# EasyEDA Pro project ProDoc_Board3_2024-07-15.epro

# Schematic Schematic1
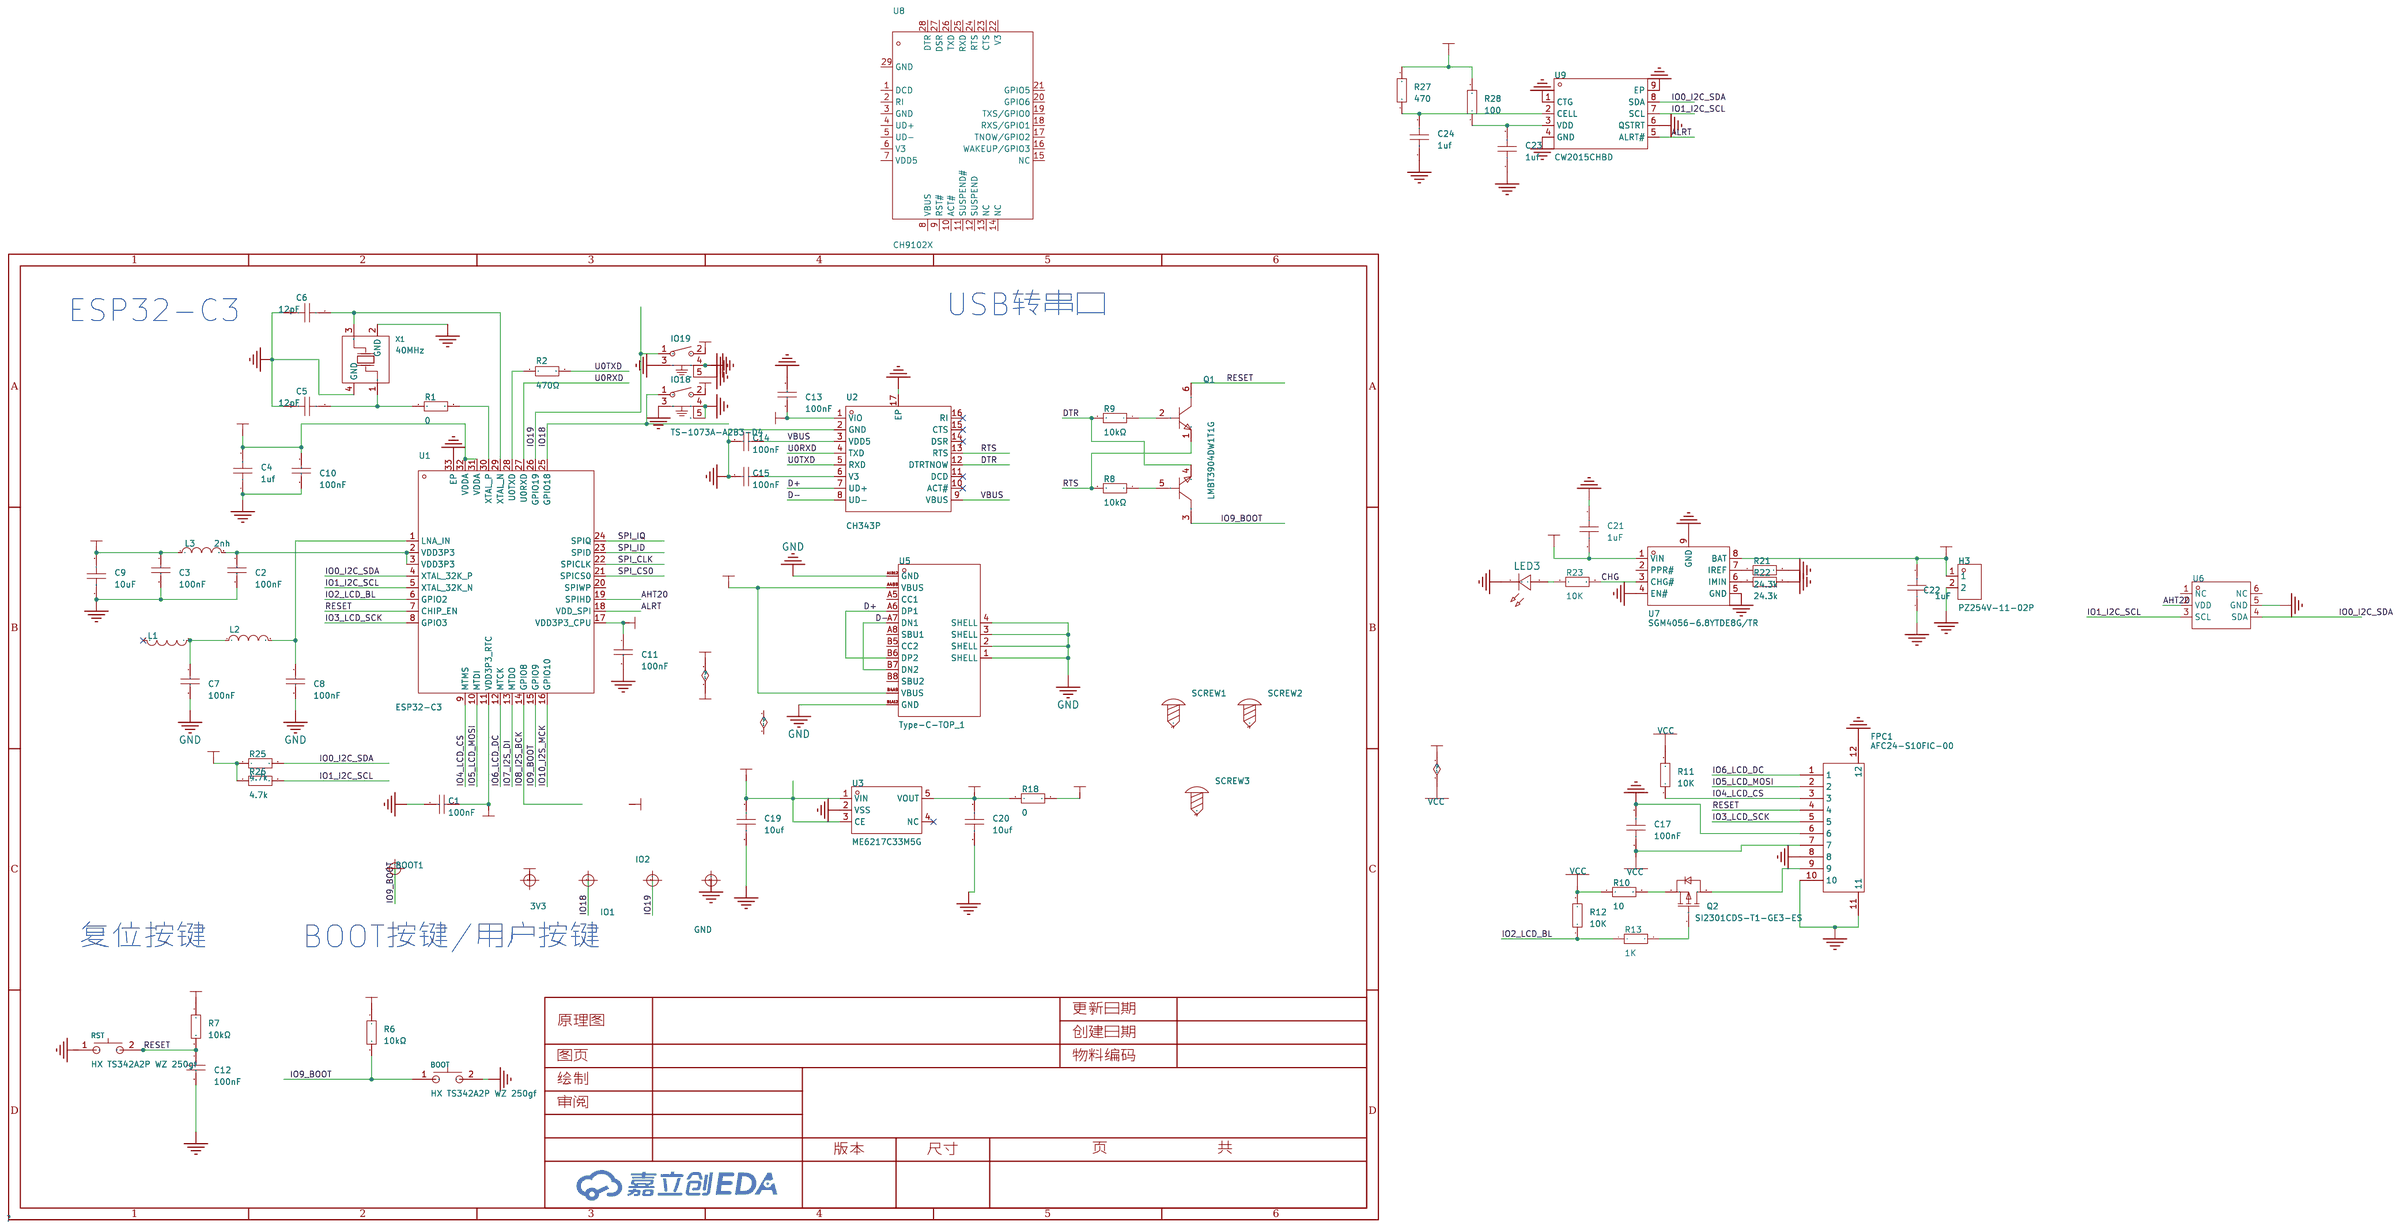
[diagram p0: schematic sheet]

## Parts
3V3  -  [Mark-Point-1mm]  (no BOM)
BOOT  HX TS342A2P WZ 250gf  [SW-SMD_L4.0-W2.9-LS5.0]
BOOT1  -  [Mark-Point-1mm]  (no BOM)
C1  100nF  [C0402]
C2  100nF  [C0402]
C3  100nF  [C0402]
C4  1uf  [C0603]
C5  12pF  [C0603]
C6  12pF  [C0603]
C7  100nF  [C0402]
C8  100nF  [C0402]
C9  10uF  [C0603]
C10  100nF  [C0402]
C11  100nF  [C0402]
C12  100nF  [C0402]
C13  100nF  [C0402]
C14  100nF  [C0402]
C15  100nF  [C0402]
C17  100nF  [C0603]
C19  10uf  [C0603]
C20  10uf  [C0603]
C21  1uF  [C0603]
C22  1uF  [C0603]
C23  1uf  [C0603]
C24  1uf  [C0603]
FPC1  AFC24-S10FIC-00  [FPC-SMD_P0.50-10P_QCHF-SM-H2.0]
GND  -  [Mark-Point-1mm]  (no BOM)
H3  PZ254V-11-02P  [HDR-TH_2P-P2.54-V-M]
IO1  -  [Mark-Point-1mm]  (no BOM)
IO2  -  [Mark-Point-1mm]  (no BOM)
IO18  TS-1073A-A2B3-D4  [SW-SMD_TS-1073A-A2B3-D4]
IO19  TS-1073A-A2B3-D4  [SW-SMD_TS-1073A-A2B3-D4]
L1  -  [ANT-SMD_L9.5-W2.1]
L2  2.2nH  [L0603]
L3  2nh  [l0603]
LED3  -  [LED_0603]
Q1  LMBT3904DW1T1G  [SOT-363_L2.0-W1.3-P0.65-LS2.1-BR]
Q2  SI2301CDS-T1-GE3-ES  [SOT-23-3_L2.9-W1.3-P1.90-LS2.4-BR]
R1  0  [r0603]
R2  470Ω  [R0603]
R6  10kΩ  [R0402]
R7  10kΩ  [R0402]
R8  10kΩ  [R0402]
R9  10kΩ  [R0402]
R10  10  [r0603]
R11  10K  [r0603]
R12  10K  [r0603]
R13  1K  [r0603]
R18  0  [r0603]
R21  24.3k  [R0402]
R22  24.3k  [R0402]
R23  10K  [R0402]
R25  4.7k  [R0402]
R26  4.7k  [R0402]
R27  470  [r0603]
R28  100  [r0603]
RST  HX TS342A2P WZ 250gf  [SW-SMD_L4.0-W2.9-LS5.0]
SCREW1  -  [M2螺丝]
SCREW2  -  [M2螺丝]
SCREW3  -  [M2螺丝]
U1  ESP32-C3  [QFN-32_L5.0-W5.0-P0.50-TL-EP3.7]
U2  CH343P  [TQFN-16_L3.0-W3.0-P0.50-BL-EP1.7]
U3  ME6217C33M5G  [SOT-23-5_L3.0-W1.7-P0.95-LS2.8-BR]
U5  Type-C-TOP_1  [USB-C-SMD_TYPE-C16PIN]
U6  AHT20  [SENSOR-SMD_L3.0-W3.0-P1.00-BR]
U7  SGM4056-6.8YTDE8G/TR  [DFN-8_L2.0-W2.0-P0.50-BL-EP-1]
U8  CH9102X  [TQFN-28_L5.0-W5.0-P0.50-BL-EP2.7]
U9  CW2015CHBD  [TDFN-8_L3.0-W2.0-P0.50-BL-EP]
X1  40MHz  [CRYSTAL-SMD_4P-L3.2-W2.5-BL-2]

## Library data of the parts
3V3 BOOT1 GND IO1 IO2 = Mark-Point: Mark点
BOOT RST = HX TS342A2P WZ 250gf: 开关长度:4mm;开关宽度:3mm;开关高度:2.5mm;机械寿命:-;; LCSC Part Name: 4*3*2.5mm 立贴 轻触开关; Supplier Part: C5143624; Manufacturer: hanxia(韩下); Supplier Footprint: SMD; JLCPCB Part Class: 扩展库; Datasheet: https://atta.szlcsc.com/upload/public/pdf/source/20220824/BD4643BA1524EF20DD35ADAFF82B8650.pdf; Supplier: LCSC; Switch Length: 4mm; Switch Width: 3mm; Switch Height: 2.5mm
C1-C3 C7 C8 C10-C15 = CL05B104KO5NNNC: 容值:100nF;精度:±10%;额定电压:16V;材质(温度系数):X7R;; LCSC Part Name: 100nF ±10% 16V; Supplier Part: C1525; Manufacturer: SAMSUNG(三星); Supplier Footprint: 0402; Datasheet: https://atta.szlcsc.com/upload/public/pdf/source/20160218/1457707763339.pdf; Supplier: LCSC; Tolerance: ±10%; Voltage Rated: 16V; Temperature Coefficient: X7R
C4-C6 C9 C17 C19-C24 = CAP_0603: Supplier Footprint: 0603
FPC1 = AFC24-S10FIC-00: 锁定特性:翻盖式;触点类型:双侧触点/上下接;触点数量:10P;间距:0.5mm;安装类型:卧贴;; LCSC Part Name: 间距:0.5mm P数:10P 翻盖式 双侧触点/上下接; Supplier Part: C262289; Manufacturer: JS(钜硕电子); Supplier Footprint: SMD,P=0.5mm,卧贴; JLCPCB Part Class: 扩展库; Datasheet: https://atta.szlcsc.com/upload/public/pdf/source/20180814/C262679_7FB2CAD07E71B2E22E52A118EE33337B.pdf; Supplier: LCSC; Locking Feature: 翻盖式; Contact Type: 双侧触点/上下接; Number of Contacts: 10P; Pitch: 0.5mm; Mounting Type: 卧贴; FFC, FCB Thickness: 0.3mm; Height Above Board: 2mm
H3 = PZ254V-11-02P: 插针结构:1x2P;间距:2.54mm;行距:-;圆针/方针:方针;安装类型:直插;排数:单排;总PIN位数:2P;额定电流:-;额定电压:-;配合针长度:6mm;塑高:2.5mm;端接针长度:3mm;触头材质:黄铜;触头镀层:-;工作温度范围:-40℃~+105℃;颜色:黑色;; LCSC Part Name: 间距:2.54mm 1x2P 直插 方针; Supplier Part: C492401; Manufacturer: XFCN(兴飞); Supplier Footprint: 插件,P=2.54mm; JLCPCB Part Class: 扩展库; Datasheet: https://atta.szlcsc.com/upload/public/pdf/source/20200309/C492401_A812433581A9B211A7FFA413ADDFF0E5.pdf; Supplier: LCSC; Pin Structure: 1x2P; Pitch: 2.54mm; Circluar Pins/Square Pins: 方针; Mounting Type: 直插; Number of Rows: 单排; Number of Pins: 2P; Length of Mating Pin: 6mm; Insulation Height: 2.5mm; Length of End Connection Pin: 3mm; Contact Material: 黄铜; Operating Temperature Range: -40℃~+105℃; Color: 黑色
IO18 IO19 = TS-1073A-A2B3-D4: 电路结构:单刀单掷;按钮形状:矩形按钮;作用力:250gf;安装方式:-;带灯:-;机械寿命:-;; LCSC Part Name: 轻触开关4.7*1.9*3.5mm侧按2*4*3.5贴片带支架250gf; Supplier Part: C492941; Manufacturer: Yuandi(元迪); JLCPCB Part Class: 扩展库; Datasheet: https://atta.szlcsc.com/upload/public/pdf/source/20200316/C492940_9943A0CF404D08218361BA1FDE575510.pdf; Supplier: LCSC; Circuit: 单刀单掷; Actuator Style: 矩形按钮; Operating Force: 250gf
L1 = AN9520-245: 2.4G陶瓷天线/适用于WIFI蓝牙; Supplier Part: C99665; Manufacturer: rainsun台湾霖昱微; Supplier Footprint: 贴片; JLCPCB Part Class: Extended Part; Datasheet: https://atta.szlcsc.com/upload/public/pdf/source/20170425/1493115807294.pdf; Supplier: LCSC; Frequency Range: 2.45GHz
L2 = SDCL1608C2N2STDF: 电感值:2.2nH;精度:±0.3nH;额定电流:500mA;饱和电流(Isat):-;直流电阻(DCR):100mΩ;; LCSC Part Name: 2.2nH ±0.3nH 500mA 100mΩ; Supplier Part: C29682; Manufacturer: Sunlord(顺络); Supplier Footprint: 0603; JLCPCB Part Class: Extended Part; Datasheet: https://atta.szlcsc.com/upload/public/pdf/source/20210916/2389196E6DC4CA1121B2D3610B126F46.pdf; Supplier: LCSC; Tolerance: ±0.3nH; Rated Current: 500mA; DC Resistance (DCR): 100mΩ
L3 = L_0603: Supplier Footprint: L0603
LED3 = LED_0603-R: Supplier Footprint: 0603
Q1 = LMBT3904DW1T1G: 晶体管类型:2个NPN;集射极击穿电压(Vceo):40V;集电极电流(Ic):200mA;功率(Pd):150mW;直流电流增益(hFE@Ic,Vce):100@10mA,1V;; Supplier: LCSC; Manufacturer: LRC(乐山无线电); Supplier Part: C131781; LCSC Part Name: 2个NPN 耐压:40V 电流:200mA; Supplier Footprint: SC-88; Datasheet: https://atta.szlcsc.com/upload/public/pdf/source/20170918/C131781_1505703476125975491.pdf; Transistor Type: 2个NPN; Collector-Emitter Breakdown Voltage (Vceo): 40V; Collector Current (Ic): 200mA; Power Dissipation (Pd): 150mW; Collector-Emitter Saturation Voltage (VCE(sat)@Ic,Ib): 300mV@50mA,5mA; DC Current Gain (hFE@Ic,Vce): 100@10mA,1V; Transition Frequency (fT): 300MHz; Operating Temperature: -55℃~+150℃@(Tj)
Q2 = SI2301CDS-T1-GE3-ES: 类型:P沟道;漏源电压(Vdss):20V;连续漏极电流(Id):3A;功率(Pd):1W;导通电阻(RDS(on)@Vgs,Id):58mΩ@4.5V,3A;; LCSC Part Name: P沟道 20V 3A; Supplier Part: C5224168; Manufacturer: ElecSuper(静芯微）; Supplier Footprint: SOT-23; Datasheet: https://atta.szlcsc.com/upload/public/pdf/source/20221027/42CFC3ED47648D38F0E217DE38FA5A17.pdf; Supplier: LCSC; Type: P沟道; Drain Source Voltage (Vdss): 20V; Continuous Drain Current (Id): 3A; Power Dissipation (Pd): 1W; Drain Source On Resistance (RDS(on)@Vgs,Id): 58mΩ@4.5V,3A; Gate Threshold Voltage (Vgs(th)@Id): 700mV@250uA
R1 R10-R13 R18 R27 R28 = Res_0603: Supplier Footprint: 0603
R2 = 0603WAF4700T5E: 电阻类型:厚膜电阻;阻值:470Ω;精度:±1%;功率:1/10W;温度系数:±100ppm/;最大工作电压:75V;工作温度范围:-55~+155;; LCSC Part Name: 470Ω ±1%; Supplier Part: C23179; Manufacturer: UNI-ROYAL(厚声); Supplier Footprint: 0603; JLCPCB Part Class: Basic Part; Datasheet: https://atta.szlcsc.com/upload/public/pdf/source/20200306/C422600_1E6D84923E4A46A82E41ADD87F860B5C.pdf; Supplier: LCSC; Type: 厚膜电阻; Tolerance: ±1%; Power(Watts): 1/10W; Temperature Coefficient: ±100ppm/; Overload Voltage (Max): 75V; Operating Temperature Range: -55~+155
R6-R9 = 0402WGF1002TCE: 电阻类型:厚膜电阻;阻值:10kΩ;精度:±1%;功率:62.5mW;温度系数:±100ppm/℃;; LCSC Part Name: 厚膜电阻 10kΩ ±1% 62.5mW; Supplier Part: C25744; Manufacturer: UNI-ROYAL(厚声); Supplier Footprint: 0402; Datasheet: https://atta.szlcsc.com/upload/public/pdf/source/20200306/C422600_1E6D84923E4A46A82E41ADD87F860B5C.pdf; Supplier: LCSC; Type: 厚膜电阻; Tolerance: ±1%; Power(Watts): 62.5mW; Temperature Coefficient: ±100ppm/℃; Overload Voltage (Max): 50V; Operating Temperature Range: -55℃~+155℃
R21-R23 R25 R26 = Res_0402: Supplier Footprint: 0402
SCREW1-SCREW3 = M2螺丝: Supplier Footprint: 插件
U1 = ESP32-C3: CPU内核:RISC-V;CPU最大主频:160MHz;工作电压范围:3V~3.6V;程序存储容量:-;程序存储器类型:-;RAM总容量:400KB;GPIO端口数量:22;; Supplier Part: C2838500; Manufacturer: ESPRESSIF(乐鑫); Supplier Footprint: QFN-32-EP(5x5); JLCPCB Part Class: 扩展库; Datasheet: https://atta.szlcsc.com/upload/public/pdf/source/20210625/C2838500_6489BE4707B1A2880AF92BF6724D19CA.pdf; Supplier: LCSC; CPU Core: RISC-V; CPU Maximum Speed: 160MHz; Operating Voltage Range: 3V~3.6V; RAM Size: 400KB; GPIO Ports Number: 22; ADC (Bit): 12bit; UART/USART: 2; I2C: 1; I2S: 1; SPI: 3; Peripheral/Function: 蓝牙协议栈；片载温度传感器；真随机数发生器；DMA；看门狗；WIFI协议栈；硬件密码算法引擎；54位Timer；PWM；RTC实时时钟; communication protocol: 蓝牙协议；WIFI协议; Watchdog: 有; Real-Time Clock: 有; Direct Memory Access: 有; Operating Temperature Range: -40℃~+105℃
U2 = CH343P: 应用功能:-;接口协议:-;; Supplier Part: C2846043; Manufacturer: WCH(南京沁恒); Supplier Footprint: TQFN-16-EP(3x3); Datasheet: https://atta.szlcsc.com/upload/public/pdf/source/20211010/C2846043_7FA705E1F14A2906F6A2AFA45FA28209.pdf; Supplier: LCSC
U3 = ME6217C33M5G: 输出类型:固定;输出极性:正;最大输入电压:7V;输出电压:3.3V;输出电流:800mA;电源纹波抑制比(PSRR):65dB@(1kHz);; Supplier Part: C427602; Manufacturer: MICRONE(南京微盟); Supplier Footprint: SOT-23-5; Datasheet: https://atta.szlcsc.com/upload/public/pdf/source/20190910/C427602_D4B9162A2E9D9EF57C60010DFDECEF37.pdf; Supplier: LCSC; Output Type: 固定; Output Polarity: 正; Number of Outputs: 1; Maximum Input Voltage: 7V; Output Voltage: 3.3V; Dropout Voltage: 180mV@(300mA); Output Current: 800mA; Power Supply Rejection Ratio (PSRR): 65dB@(1kHz)
U5 = Type-C-TOP_1: Supplier Part: C9900005857; Supplier Footprint: Type-C16P; JLCPCB Part Class: 扩展库; Supplier: LCSC
U6 = AHT20: Supplier Part: C2757850; Manufacturer: 广州奥松; Supplier Footprint: SMD; JLCPCB Part Class: 扩展库; Datasheet: https://atta.szlcsc.com/upload/public/pdf/source/20231023/00557B34ED120268320A4810FF8DED4D.pdf; Supplier: LCSC
U7 = SGM4056-6.8YTDE8G/TR: Supplier Part: C699732; Manufacturer: SGMICRO(圣邦微); Supplier Footprint: TDFN-8L(2x2); JLCPCB Part Class: 扩展库; Supplier: LCSC
U8 = CH9102X_C5187522: 应用功能:USB转UART;; Supplier Part: C5187522; Manufacturer: WCH(南京沁恒); Supplier Footprint: QFN-28(5x5); JLCPCB Part Class: 扩展库; Datasheet: https://atta.szlcsc.com/upload/public/pdf/source/20240313/AF0D9A0C8A705CD7DAC68F5AA4A0187A.pdf; Supplier: LCSC; Applications Function: USB转UART; Supply Voltage: 1.8V~5V
U9 = CW2015CHBD: Supplier Part: C881838; Manufacturer: Cellwise(赛微); Supplier Footprint: TDFN-8-EP(2x3); Datasheet: https://atta.szlcsc.com/upload/public/pdf/source/20210512/C881838_09B0689D9538DF441B283DD8D668F2A7.pdf; Supplier: LCSC
X1 = TXM40M0004322HBCEO00T: 频率:40MHz;频率公差:±10ppm;负载电容:15pF;; LCSC Part Name: 40MHz ±10ppm 15pF; Supplier Part: C284179; Manufacturer: TAE(雅晶鑫); Supplier Footprint: SMD3225-4P; Datasheet: https://atta.szlcsc.com/upload/public/pdf/source/20180910/C284179_2ACC6381EF288E18F29855CB4CF503EF.pdf; Supplier: LCSC; Crystal Type: 贴片无源晶振; Frequency Tolerance: ±10ppm; Frequency Stability: ±30ppm; Load Capacitance: 15pF; Equivalent Series Resistance (ESR): 30Ω; Operating Temperature: -40℃~+85℃

## Nets
3V3: 3V3.1 C1.1 C3.1 C4.2 C9.2 C10.1 C11.1 C13.1 C17.1 C20.2 C22.2 FPC1.7 H3.1 IO18.2 IO19.2 L3.1 R6.1 R7.1 R10.1 R11.2 R12.2 R18.1 R25.1 R26.1 R27.2 R28.2 U1.11(VDD3P3_RTC) U1.17(VDD3P3_CPU) U1.31(VDDA) U1.32(VDDA) U2.1(VIO) U3.5(VOUT) U7.8(BAT)
+5V: C14.1 C19.2 C21.2 U2.3(VDD5) U2.9(VBUS) U3.1(VIN) U3.3(CE) U5.A4B9(VBUS) U5.B4A9(VBUS) U7.1(VIN)
GND: BOOT.2 C1.2 C2.2 C3.2 C4.1 C5.1 C6.1 C7.2 C8.2 C9.1 C10.2 C11.2 C12.2 C13.2 C14.2 C15.1 C17.2 C19.1 C20.1 C21.1 C22.1 C23.1 C24.1 FPC1.6 FPC1.8 FPC1.10 FPC1.11 FPC1.12 GND.1 H3.2 IO18.3(EP) IO18.4(EP) IO18.5(EP) IO19.3(EP) IO19.4(EP) IO19.5(EP) LED3.1(C) R21.2 R22.2 RST.1 U1.33(EP) U2.2(GND) U2.17(EP) U3.2(VSS) U5.1(SHELL) U5.2(SHELL) U5.3(SHELL) U5.4(SHELL) U5.A1B12(GND) U5.B1A12(GND) U6.5(GND) U7.4(EN#) U7.5(GND) U7.9(GND) U9.1(CTG) U9.4(GND) U9.6(QSTRT) U9.9(EP) X1.2(GND) X1.4(GND)
AHT20: U1.19(SPIHD) U6.2(VDD)
ALRT: U1.18(VDD_SPI) U9.5(ALRT#)
AU_3V3: R18.2
CHG: R23.2 U7.3(CHG#)
D+: U2.7(UD+) U5.A6(DP1) U5.B6(DP2)
D-: U2.8(UD-) U5.A7(DN1) U5.B7(DN2)
DTR: Q1.4(E) R9.2 U2.12(DTRTNOW)
IO0_I2C_SDA: R25.2 U1.4(XTAL_32K_P) U6.4(SDA) U9.8(SDA)
IO1_I2C_SCL: R26.2 U1.5(XTAL_32K_N) U6.3(SCL) U9.7(SCL)
IO2_LCD_BL: R12.1 R13.1 U1.6(GPIO2)
IO3_LCD_SCK: FPC1.5 U1.8(GPIO3)
IO4_LCD_CS: FPC1.3 R11.1 U1.9(MTMS)
IO5_LCD_MOSI: FPC1.2 U1.10(MTDI)
IO6_LCD_DC: FPC1.1 U1.12(MTCK)
IO7_I2S_DI: U1.13(MTDO)
IO8_I2S_BCK: U1.14(GPIO8)
IO9_BOOT: BOOT.1 BOOT1.1 Q1.3(C) R6.2 U1.15(GPIO9)
IO10_I2S_MCK: U1.16(GPIO10)
IO18: IO1.1 IO18.1 U1.25(GPIO18)
IO19: IO2.1 IO19.1 U1.26(GPIO19)
RESET: C12.1 FPC1.4 Q1.6(C) R7.2 RST.2 U1.7(CHIP_EN)
RTS: Q1.1(E) R8.2 U2.13(RTS)
SPI_CLK: U1.22(SPICLK)
SPI_CS0: U1.21(SPICS0)
SPI_ID: U1.23(SPID)
SPI_IQ: U1.24(SPIQ)
U0RXD: U1.27(U0RXD) U2.4(TXD)
U0TXD: R2.2 U2.5(RXD)
$1N1202: C2.1 L3.2 U1.2(VDD3P3) U1.3(VDD3P3)
$1N1206: R2.1 U1.28(U0TXD)
$1N1211: C8.1 L2.2 U1.1(LNA_IN)
$1N1212: R1.2 U1.30(XTAL_P)
$1N1213: C6.2 U1.29(XTAL_N) X1.3(OSC2)
$1N1214: C5.2 R1.1 X1.1(OSC1)
$1N1418: C7.1 L1.1 L2.1
$1N2848: C15.2 U2.6(V3)
$1N2873: Q1.5(B) R8.1
$1N2874: Q1.2(B) R9.1
$1N5150: FPC1.9 Q2.3(D)
$1N5159: Q2.1(G) R13.2
$1N5160: Q2.2(S) R10.2
$1N13318: R21.1 U7.7(IREF)
$1N13361: R22.1 U7.6(IMIN)
$1N13443: LED3.2(A) R23.1
$1N22115: C23.2 R28.1 U9.3(VDD)
$1N22200: C24.2 R27.1 U9.2(CELL)

Not connected (* = marked no-connect by the designer): L1 2*; SCREW1 1; SCREW2 1; SCREW3 1; U1 20(SPIWP); U2 10(ACT#)* 11(DCD)* 14(DSR)* 15(CTS)* 16(RI)*; U3 4(NC)*; U5 A5(CC1) A8(SBU1) B5(CC2) B8(SBU2); U6 1(NC) 6(NC); U7 2(PPR#); U8 1(DCD) 2(RI) 3(GND) 4(UD+) 5(UD-) 6(V3) 7(VDD5) 8(VBUS) 9(RST#) 10(ACT#) 11(SUSPEND#) 12(SUSPEND) 13(NC) 14(NC) 15(NC) 16(WAKEUP/GPIO3) 17(TNOW/GPIO2) 18(RXS/GPIO1) 19(TXS/GPIO0) 20(GPIO6) 21(GPIO5) 22(V3) 23(CTS) 24(RTS) 25(RXD) 26(TXD) 27(DSR) 28(DTR) 29(GND)

## Notes on the sheet
- ESP32-C3
- USB转串口
- 复位按键
- BOOT按键/用户按键

# Board PCB4
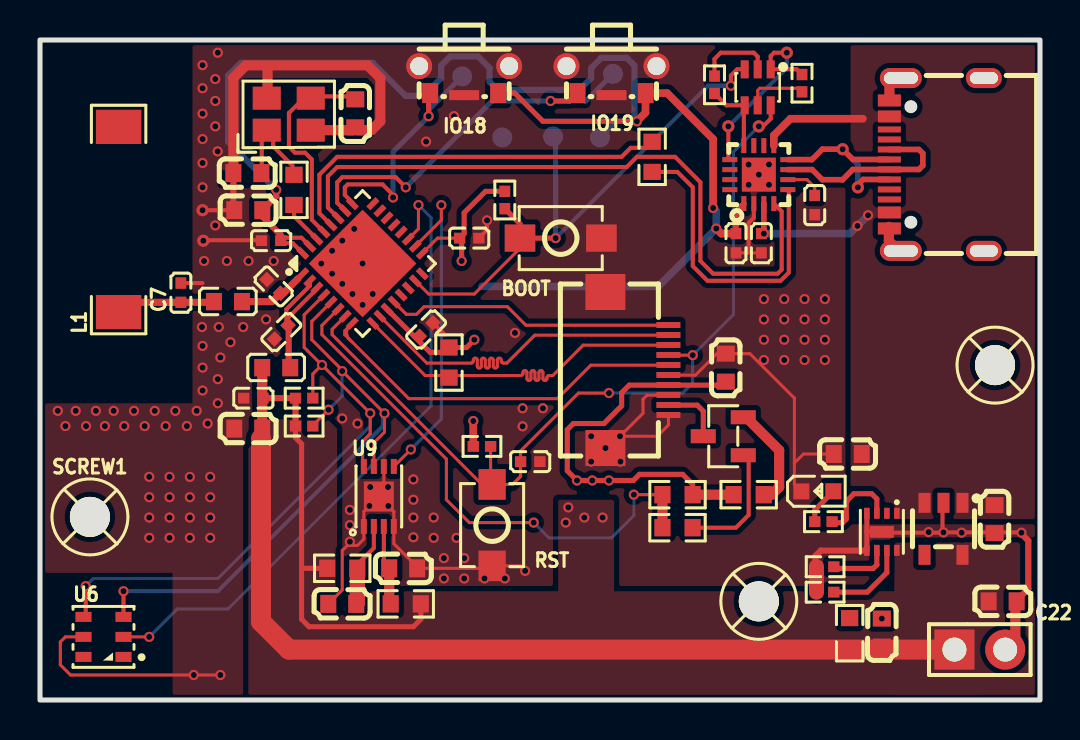
[diagram p1: board, top side]
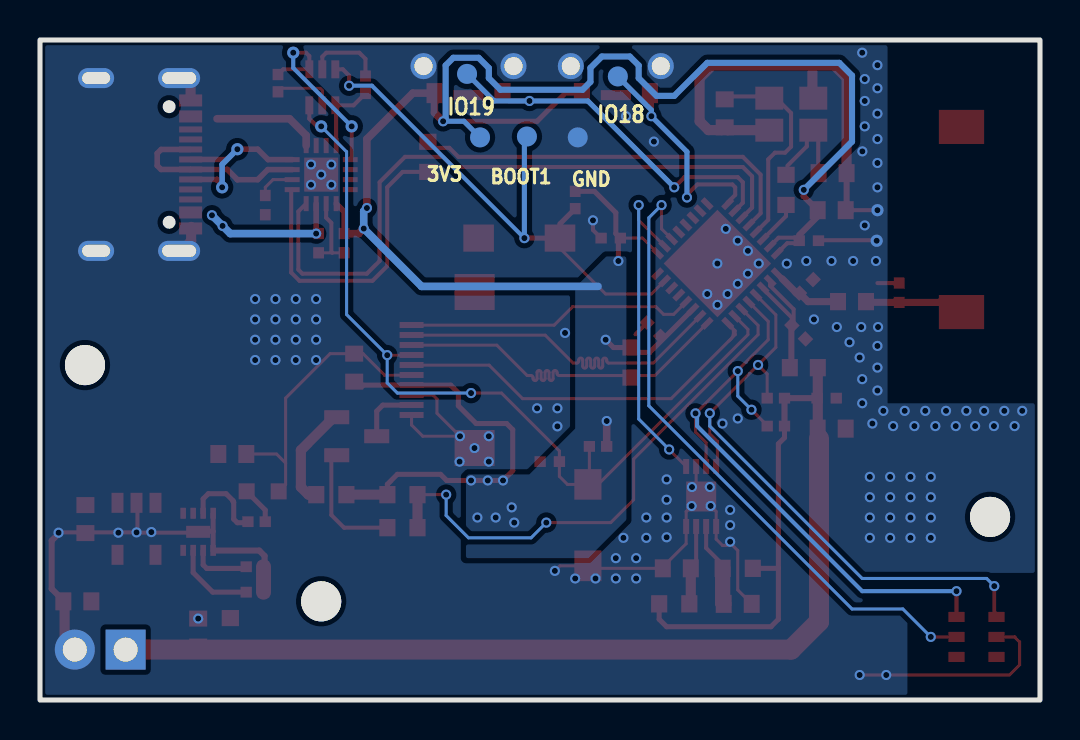
[diagram p2: board, bottom side, seen from below]

Outline 50 x 33 mm; copper layers: Top Layer, Bottom Layer. Coordinates in mm from the lower left corner of the outline.
Outline path: rectangle 0,33 50,0
Stack: Top Layer 0.035mm / Dielectric1 1.51mm FR4 er 4.5 / Bottom Layer 0.035mm

## Design rules (mm)
net IO5_LCD_MOSI: DP2
net IO3_LCD_SCK: DP2
net D+: DP1
net D-: DP1
template: 自定义配置
spacing copperThickness1oz (default): track to track 0.102, other pairs 0.152 to 0.3
spacing copperThickness2oz: track to track 0.203, other pairs 0.152 to 0.3
track width copperThickness1oz (default): min 0.152, default 0.152, max 2.54
track width copperThickness2oz: min 0.203, default 0.254, max 2.54
differential pair differentialPair (default): width min 0.127, default 0.152, max 2.54; gap min 0.152, default 0.152
via viaSize (default): diameter min 0.5, default 0.508, max 10; hole min 0.3, default 0.305, max 6.299

## Placement (name value [footprint] x y rotation side)
3V3  -  [Mark-Point-1mm]  28 28.13 180 bottom
BOOT  HX TS342A2P WZ 250gf  [SW-SMD_L4.0-W2.9-LS5.0]  26.03 23.09 0 top
BOOT1  -  [Mark-Point-1mm]  25.65 28.17 180 bottom
C1  100nF  [C0402]  21.46 23.09 0 top
C2  100nF  [C0402]  12.06 18.39 225 top
C3  100nF  [C0402]  10.67 15.09 180 top
C4  1uf  [C0603]  10.41 24.49 0 top
C5  12pF  [C0603]  10.37 26.34 0 top
C6  12pF  [C0603]  15.76 29.33 90 top
C7  100nF  [C0402]  7.04 20.36 90 top
C8  100nF  [C0402]  11.68 20.68 135 top
C9  10uF  [C0603]  10.41 13.57 0 top
C10  100nF  [C0402]  11.56 22.97 180 top
C11  100nF  [C0402]  19.3 18.52 45 top
C12  100nF  [C0402]  24.51 11.92 0 top
C13  100nF  [C0402]  34.8 22.84 270 top
C14  100nF  [C0402]  36.07 22.84 270 top
C15  100nF  [C0402]  38.74 24.75 90 top
C17  100nF  [C0603]  34.29 16.62 90 top
C19  10uf  [C0603]  47.73 9.04 90 top
C20  10uf  [C0603]  42.09 3.37 270 top
C21  1uF  [C0603]  40.39 12.3 0 top
C22  1uF  [C0603]  48.13 4.93 180 top
C23  1uf  [C0603]  18.16 6.58 180 top
C24  1uf  [C0603]  15.11 4.81 0 top
FPC1  AFC24-S10FIC-00  [FPC-SMD_P0.50-10P_QCHF-SM-H2.0]  29.84 16.5 90 top
GND  -  [Mark-Point-1mm]  23.11 28.13 180 bottom
H3  PZ254V-11-02P  [HDR-TH_2P-P2.54-V-M]  46.99 2.52 0 top
IO1  -  [Mark-Point-1mm]  21.11 31.18 180 bottom
IO2  -  [Mark-Point-1mm]  28.65 31.31 180 bottom
IO18  TS-1073A-A2B3-D4  [SW-SMD_TS-1073A-A2B3-D4]  21.21 30.97 0 top
IO19  TS-1073A-A2B3-D4  [SW-SMD_TS-1073A-A2B3-D4]  28.57 30.97 0 top
L1  -  [ANT-SMD_L9.5-W2.1]  3.93 24.02 90 top
L2  2.2nH  [L0603]  9.4 19.92 0 top
L3  2nh  [l0603]  11.81 16.62 0 top
LED3  -  [LED_0603]  38.92 10.44 0 top
Q1  LMBT3904DW1T1G  [SOT-363_L2.0-W1.3-P0.65-LS2.1-BR]  35.88 30.63 90 top
Q2  SI2301CDS-T1-GE3-ES  [SOT-23-3_L2.9-W1.3-P1.90-LS2.4-BR]  34.16 13.19 0 top
R1  0  [r0603]  12.7 25.51 270 top
R2  470Ω  [R0603]  30.61 27.16 270 top
R6  10kΩ  [R0402]  23.24 25 270 top
R7  10kΩ  [R0402]  22.1 12.68 0 top
R8  10kΩ  [R0402]  38.1 30.84 90 top
R9  10kΩ  [R0402]  33.73 30.76 270 top
R10  10  [r0603]  35.43 10.27 0 top
R11  10K  [r0603]  20.45 16.87 90 top
R12  10K  [r0603]  31.88 10.27 0 top
R13  1K  [r0603]  31.88 8.62 0 top
R18  0  [r0603]  40.48 3.34 90 top
R21  24.3k  [R0402]  39.26 5.39 180 top
R22  24.3k  [R0402]  39.26 6.66 180 top
R23  10K  [R0402]  39.17 8.92 0 top
R25  4.7k  [R0402]  13.21 15.09 0 top
R26  4.7k  [R0402]  13.21 13.7 0 top
R27  470  [r0603]  15.11 6.58 180 top
R28  100  [r0603]  18.29 4.81 0 top
RST  HX TS342A2P WZ 250gf  [SW-SMD_L4.0-W2.9-LS5.0]  22.61 8.74 90 top
SCREW1  -  [M2螺丝]  2.5 9.16 0 top
SCREW2  -  [M2螺丝]  47.75 16.74 0 top
SCREW3  -  [M2螺丝]  35.94 4.93 0 top
U1  ESP32-C3  [QFN-32_L5.0-W5.0-P0.50-TL-EP3.7]  16.13 21.82 45 top
U2  CH343P  [TQFN-16_L3.0-W3.0-P0.50-BL-EP1.7]  35.94 26.27 0 top
U3  ME6217C33M5G  [SOT-23-5_L3.0-W1.7-P0.95-LS2.8-BR]  45.17 8.56 90 top
U5  Type-C-TOP_1  [USB-C-SMD_TYPE-C16PIN]  44.83 26.78 90 top
U6  AHT20  [SENSOR-SMD_L3.0-W3.0-P1.00-BR]  3.17 3.16 0 top
U7  SGM4056-6.8YTDE8G/TR  [DFN-8_L2.0-W2.0-P0.50-BL-EP-1]  42.09 8.41 180 top
U9  CW2015CHBD  [TDFN-8_L3.0-W2.0-P0.50-BL-EP]  16.94 10.18 0 top
X1  40MHz  [CRYSTAL-SMD_4P-L3.2-W2.5-BL-2]  12.44 29.29 0 top

## Footprints (pads in the part's own frame, mm; a bottom-side part is the same pattern mirrored in y, then rotated)
ANT-SMD_L9.5-W2.1
  rect 1.71x2.268 smd: 1(-4.63,0) 2(4.63,0)
C0402
  rect 0.566x0.54 smd: 1(-0.481,0) 2(0.481,0)
C0603
  rect 0.8x0.9 smd: 1(-0.7,0) 2(0.7,0)
CRYSTAL-SMD_4P-L3.2-W2.5-BL-2
  rect 1.4x1.15 smd: 1(-1.1,-0.8) 2(1.1,-0.8) 3(1.1,0.8) 4(-1.1,0.8)
DFN-8_L2.0-W2.0-P0.50-BL-EP-1
  rect 0.28x0.55 smd: 1(-0.75,-0.927) 2(-0.25,-0.927) 3(0.25,-0.927) 4(0.75,-0.927) 5(0.75,0.927) 6(0.25,0.927) 7(-0.25,0.927) 8(-0.75,0.927)
  rect 1.2x0.6 smd: 9(0,0)
FPC-SMD_P0.50-10P_QCHF-SM-H2.0
  rect 0.3x1.2 smd: 1(2.25,-1.575) 2(1.752,-1.576) 3(1.252,-1.576) 4(0.752,-1.576) 5(0.252,-1.576) 6(-0.248,-1.576) 7(-0.748,-1.576) 8(-1.248,-1.576) 9(-1.748,-1.576) 10(-2.248,-1.576)
  rect 1.8x2 smd: 11(3.9,1.576) 12(-3.9,1.575)
HDR-TH_2P-P2.54-V-M
  rect 2x2 hole 1.2: 1(-1.27,0)
  round 2 hole 1.2: 2(1.27,0)
L0603
  rect 0.8x0.864 smd: 1(-0.7,0) 2(0.7,0)
l0603
  rect 0.8x0.864 smd: 1(-0.7,0) 2(0.7,0)
LED_0603
  rect 0.8x0.8 smd: 1(-0.851,-0.01) 2(0.75,-0.005)
M2螺丝
  round 2 hole 2: 1(0,0)
Mark-Point-1mm
  round 1 smd: 1(0,0)
QFN-32_L5.0-W5.0-P0.50-TL-EP3.7
  rect 0.65x0.28 smd: 1(-2.478,1.75) 2(-2.478,1.25) 3(-2.478,0.75) 4(-2.478,0.25) 5(-2.478,-0.25) 6(-2.478,-0.75) 7(-2.478,-1.25) 8(-2.478,-1.75) 17(2.478,-1.75) 18(2.478,-1.25) 19(2.478,-0.75) 20(2.478,-0.25) 21(2.478,0.25) 22(2.478,0.75) 23(2.478,1.25) 24(2.478,1.75)
  rect 0.28x0.65 smd: 9(-1.75,-2.478) 10(-1.25,-2.478) 11(-0.75,-2.478) 12(-0.25,-2.478) 13(0.25,-2.478) 14(0.75,-2.478) 15(1.25,-2.478) 16(1.75,-2.478) 25(1.75,2.478) 26(1.25,2.478) 27(0.75,2.478) 28(0.25,2.478) 29(-0.25,2.478) 30(-0.75,2.478) 31(-1.25,2.478) 32(-1.75,2.478)
  rect 3.8x3.8 smd: 33(0,0)
R0402
  rect 0.566x0.54 smd: 1(-0.433,0) 2(0.433,0)
R0603
  rect 0.806x0.864 smd: 1(-0.753,0) 2(0.753,0)
r0603
  rect 0.806x0.864 smd: 1(-0.753,0) 2(0.753,0)
SENSOR-SMD_L3.0-W3.0-P1.00-BR
  rect 0.8x0.5 smd: 1(1,-1) 2(1,0) 3(1,1) 4(-1,1) 5(-1,0) 6(-1,-1)
SOT-23-3_L2.9-W1.3-P1.90-LS2.4-BR
  rect 1.25x0.7 smd: 1(1,-0.95) 2(1,0.95) 3(-1,0)
SOT-23-5_L3.0-W1.7-P0.95-LS2.8-BR
  rect 1x0.6 smd: 1(1.3,-0.95) 2(1.3,0) 3(1.3,0.95) 4(-1.3,0.95) 5(-1.3,-0.95)
SOT-363_L2.0-W1.3-P0.65-LS2.1-BR
  rect 0.9x0.4 smd: 1(0.9,-0.65) 2(0.9,0) 3(0.9,0.65) 4(-0.9,0.65) 5(-0.9,0) 6(-0.9,-0.65)
SW-SMD_L4.0-W2.9-LS5.0
  rect 1.53x1.36 smd: 1(-2.035,0) 2(2.035,0)
SW-SMD_TS-1073A-A2B3-D4
  rect 0.8x1 smd: 1(-1.7,-0.625) 2(1.7,-0.625)
  round 1.3 hole 0.9: 3(-2.25,0.725) 4(2.25,0.725)
  rect 1.5x0.5 smd: 5(0,-0.725)
TDFN-8_L3.0-W2.0-P0.50-BL-EP
  rect 0.3x0.75 smd: 1(-0.75,-1.5) 2(-0.249,-1.5) 3(0.25,-1.5) 4(0.75,-1.5) 5(0.75,1.5) 6(0.25,1.5) 7(-0.249,1.5) 8(-0.75,1.5)
  rect 1.5x1.5 smd: 9(-0.001,-0.001)
TQFN-16_L3.0-W3.0-P0.50-BL-EP1.7
  rect 0.25x0.75 smd: 1(-0.749,-1.45) 2(-0.248,-1.45) 3(0.252,-1.45) 4(0.751,-1.45) 9(0.75,1.45) 10(0.25,1.45) 11(-0.25,1.45) 12(-0.749,1.45)
  rect 0.75x0.25 smd: 5(1.45,-0.75) 6(1.45,-0.25) 7(1.45,0.25) 8(1.45,0.75) 13(-1.45,0.75) 14(-1.45,0.25) 15(-1.45,-0.25) 16(-1.45,-0.75)
  rect 1.7x1.7 smd: 17(0.001,0)
USB-C-SMD_TYPE-C16PIN
  oval 1x2.1 hole 0.6x1.7: 1(-4.32,1.788) 2(4.32,1.788)
  oval 1x1.8 hole 0.6x1.4: 3(-4.32,-2.362) 4(4.32,-2.362)
  rect 0.6x1.15 smd: A1B12(-3.2,2.362) A4B9(-2.4,2.362) B1A12(3.2,2.362) B4A9(2.4,2.362)
  rect 0.3x1.15 smd: A5(-1.25,2.362) A6(-0.25,2.362) A7(0.25,2.362) A8(-1.75,2.362) B5(1.75,2.362) B6(0.75,2.362) B7(-0.75,2.362) B8(1.25,2.362)

## Nets
As in the schematic.

Pads without a net: L1 2; SCREW1 1; SCREW2 1; SCREW3 1; U1 20; U2 10 11 14 15 16; U3 4; U5 A5 A8 B5 B8; U6 1 6; U7 2

## Via types
v1: diameter 0.508, hole 0.305, Top Layer to Bottom Layer, 171 vias
v2: diameter 0.61, hole 0.305, Top Layer to Bottom Layer, 7 vias

## Routing (per net, layer and track width the routed paths; a pad name or vN(x,y) marks a point on that pad's centre or on a via; arc(x,y) is an arc through that point)
3V3: length 178.7
  Top Layer w0.152: U1.17 19.87,23.09 C1.1
  Top Layer w0.203: 12.32,22.84 12.64,22.84 U1.32 ; 12.09,23.12 13.07,23.12 13.48,22.71
  Top Layer w0.254: 33.91,15.67 33.83,15.74 29.46,15.74 29.08,15.36 29.08,14.71 28.19,13.82 26.67,13.82 26.36,13.52 26.36,11.46 v1(26.85,10.98) v1(27.61,10.98) v1(28.45,10.98) 29.67,10.98 29.97,11.28 32.13,11.28 32.63,10.78 R12.2 ; v1(29.84,28.94) 25.15,28.94 23.74,30.34 IO18.2 ; v1(21.72,18.01) 21.33,17.62 R11.2 20.2,17.38 19.51,17.38 U1.11 ; R28.2 19.04,4.04 18.67,3.66 13.45,3.66 13.08,4.04 13.08,6.6 ; 13.08,6.6 13.1,6.58 R27.2 ; 13.08,6.6 13.08,12.81 12.78,13.11 R26.1 ; v1(21.08,21.95) 21.08,22.99 C1.1 21.21,23.32 21.21,24.36 22.28,25.43 R6.1
  Top Layer w0.28: U2.1 34.8,24.42 C13.1
  Top Layer w0.305: C3.1 R25.1 R26.1 ; v1(11.81,25.51) 11.81,25.19 C4.2 11.11,24.17 12.03,23.26 12.03,22.96
  Top Layer w0.381: C13.1 34.06,23.32 v1(33.81,23.57) ; v1(33.66,24.6) 33.66,28.05 31.36,30.34 30.28,30.34 30.28,29.37 v1(29.84,28.94) ; 21.66,12.68 v1(21.66,13.95)
  Top Layer w0.508: C9.2 11.11,13.57 L3.1 ; R12.2 R10.1
  Top Layer w1.001: 11.05,13.06 11.05,3.92 12.45,2.52 H3.1
  Bottom Layer w0.254: v1(29.84,28.94) 28.8,28.94 3V3.1
  Bottom Layer w0.305: v1(11.81,25.51) 9.4,27.92 9.4,31.22 10.03,31.86 16.64,31.86 18.29,30.21 19.18,30.21 20.06,31.09 20.06,31.73 20.51,32.17 21.91,32.17 22.48,31.6 22.48,30.9 22.87,30.51 26.97,30.51 27.56,31.09 27.56,31.6 28.07,32.11 29.34,32.11 29.72,31.73 29.72,29.06 v1(29.84,28.94)
  Bottom Layer w0.381: v1(33.66,24.6) 33.81,24.44 v1(33.81,23.57) 30.92,20.68 22.1,20.68
  vias: v1(26.29,8.87) v1(26.42,9.63) v1(27.22,9.12) v1(28.13,9.12)
+5V: length 12.5
  Top Layer w0.28: C14.1 36.19,23.32 v1(36.19,23.32) U2.3
  Top Layer w0.381: 41.15,29.06 37.52,29.06 36.69,28.23 U2.9
  Bottom Layer w0.381: v1(36.19,23.32) 40.48,23.32 v1(40.87,23.71) v1(41.4,24.24)
GND: length 107.7
  Top Layer w0.152: v1(24.26,6.46) 24.01,6.71 RST.1 22.48,6.58 C23.1 18.86,6.65 17.69,7.81 U9.4 17.69,9.43 v1(17.42,9.7) U9.9 ; 37.72,11.85 37.72,10.78 LED3.1 ; 37.72,11.85 38.17,12.3 C21.1 ; 37.72,11.85 37.72,15.09 35.5,17.32 C17.2 33.85,17.32 32.77,16.24 31.42,16.24 ; U6.5 1.27,3.16 1.02,2.9 1.02,1.76 1.52,1.25 v1(7.69,1.25) v1(9.02,1.25) ; U9.9 v1(16.47,9.7) 16.19,9.43 U9.1 16.19,8.04 15.88,7.73 15.37,7.73 15.11,7.47 15.11,5.51 C24.1 ; U9.9 17.19,10.43 U9.6 ; C13.2 C14.2 ; 31.42,14.24 31.42,13.75 30.86,13.19 v1(29,13.19) 30.15,14.34 30.15,15.04 30.35,15.24 31.42,15.24
  Top Layer w0.203: 42.07,8.37 45.16,8.37 v1(45.17,8.38) ; C11.2 20.23,18.28 ; C7.2 8.13,20.85 ; C1.2 22.35,23.5 v1(22.35,23.98) ; v2(8.13,24.49) C4.1 ; U2.2 35.69,24.12 35.43,23.86 35.43,22.4 35.39,22.36 ; 49.06,8.38 v1(45.17,8.38) ; v1(45.17,8.38) 45.13,8.43 45.13,9.84 ; 11.03,22.99 8.19,22.99 v2(8.17,22.96)
  Top Layer w0.254: U7.5 41.34,8.44 ; 41.34,8.44 U7.4 ; 41.34,8.44 42.07,8.44 ; 48.38,2.68 48.77,3.07
  Top Layer w0.305: 41.32,7.47 39.04,7.47 38.77,7.2 38.77,6.77 ; 9.43,24.49 9.67,24.73 C5.1 ; 48.84,4.98 49.42,5.56 49.42,7.97 49.09,8.3
  Top Layer w0.508: 48.77,3.07 48.77,4.86 ; 42.47,30.03 42.47,30.81 42.72,31.05 ; X1.2 15.62,28.49 C6.1 15.9,28.49 16.58,28.49 17.02,28.94 17.02,31.09 16.38,31.73 10.29,31.73 9.67,31.11 C5.1 ; 11.38,31.49 11.38,30.21 11.18,30.01 ; 42.97,22.42 42.44,22.95 42.44,23.65
  Top Layer w0.75: R21.2 R22.2
  vias: v1(0.89,14.46) v1(1.27,13.7) v1(1.79,14.46) v1(2.3,13.7) v1(2.79,14.46) v1(3.24,13.7) v1(3.68,14.46) v1(4.21,13.7) v1(4.7,14.46) v1(5.23,13.7) v1(5.46,11.16) v1(5.46,10.14) v1(5.46,9.12) v1(5.46,8.11) v1(5.74,14.46) v1(6.28,13.7) v1(6.48,11.16) v1(6.48,10.14) v1(6.48,9.12) v1(6.48,8.11) v1(6.77,14.46) v1(7.34,13.7) v1(7.49,11.16) v1(7.49,10.14) v1(7.49,9.12) v1(7.49,8.11) v1(7.83,14.46) v1(8.13,31.74) v1(8.13,30.59) v1(8.13,29.32) v1(8.13,28.05) v1(8.13,26.85) v1(8.13,25.63) v1(8.1,18.65) v1(8.13,17.7) v1(8.13,16.62) v1(8.13,15.47) v1(8.2,21.95) v1(8.38,13.82) v1(8.51,11.16) v1(8.51,10.14) v1(8.51,9.12) v1(8.51,8.11) v1(8.76,31.05) v1(8.76,29.95) v1(8.76,28.68) v1(8.76,23.73) v1(8.89,32.36) v1(8.88,27.43) v1(8.94,18.65) v1(8.89,16.04) v1(8.89,14.84) v1(9.02,17.12) v1(9.34,21.95) v1(9.53,17.89) v1(10.16,18.65) v1(10.43,21.95) v1(11.3,19.03) v1(11.68,21.95) v1(12.66,21.82) v1(14.06,21.82) v1(14.6,22.46) v1(14.6,21.32) v1(15.11,22.97) v1(15.11,20.81) v1(15.11,14.08) v1(15.49,9.5) v1(15.49,8.74) v1(15.49,7.91) v1(15.62,20.3) v1(15.71,23.56) v1(15.88,13.82) v1(16.13,21.82) v1(16.13,19.76) v1(16.51,10.65) v1(16.64,20.3) v1(17.4,10.65) v1(18.67,11.03) v1(18.67,10.01) v1(18.67,9.12) v1(18.67,8.14) v1(19.3,27.92) v1(19.69,9.12) v1(19.69,8.11) v1(20.19,7.09) v1(20.19,6.08) v1(20.7,29.19) v1(20.83,8.11) v1(21.21,7.09) v1(21.21,6.08) v1(22.22,6.08) v1(23.24,6.08) v1(23.75,18.35) v1(24.13,14.58) v1(24.13,13.68) v1(25.15,14.58) v1(27.56,13.19) v1(27.56,11.92) v1(28.28,12.6) v1(29.02,11.92) v1(35.43,26.77) v1(35.43,25.76) v1(35.94,26.27) v1(36.19,20.05) v1(36.19,19.03) v1(36.19,18.01) v1(36.19,17) v1(36.45,26.78) v1(36.45,25.76) v1(37.21,20.05) v1(37.21,19.03) v1(37.21,18.01) v1(37.21,17) v1(38.23,20.05) v1(38.23,19.03) v1(38.23,18.01) v1(38.23,17) v1(39.24,20.05) v1(39.24,19.03) v1(39.24,18.01) v1(39.24,17) v1(42.09,4.07) v1(44.43,8.4) v1(46.08,8.37) v1(49.07,8.37)
AHT20: length 32.4
  Top Layer w0.152: U1.19 18.92,23.56 v1(18.92,24.75) ; U6.2 v1(5.46,3.16)
  Bottom Layer w0.152: v1(18.92,24.75) 19.56,24.11 19.56,14.71 9.4,4.55 6.86,4.55 v1(5.46,3.16)
ALRT: length 16.6
  Top Layer w0.152: U9.5 v1(18.54,12.53) ; U1.18 20.07,23.99 v1(20.07,24.75)
  Bottom Layer w0.152: v1(20.07,24.75) 20.07,14.05 v1(18.54,12.53)
CHG: length 4.2
  Top Layer w0.254: U7.3 41.84,10.06 41.58,10.31 40.7,10.31 40.35,9.97 40.35,9.92 40.31,9.89 40.31,9.04 40.13,8.86 39.66,8.86 R23.2
D+: length 9.6
  Top Layer w0.28: U5.B6 43.94,27.53 44.14,27.33 44.14,26.72 43.95,26.53 U5.A6 40.64,26.53 40.13,26.02 40.13,26.02 39.12,26.02 38.61,26.52 U2.7
D-: length 9.5
  Top Layer w0.28: U5.B7 41.16,26.03 40.89,25.76 v2(40.89,25.63) ; U5.A7 40.64,27.03 v2(40.13,27.54) 39.12,27.54 38.6,27.02 U2.8
  Bottom Layer w0.28: v2(40.13,27.54) 40.89,26.78 v2(40.89,25.63)
DTR: length 3.8
  Top Layer w0.203: R9.2 34.32,29.73 Q1.4 35.19,29.69 U2.12
IO0_I2C_SDA: length 32.1
  Top Layer w0.152: U9.8 16.13,11.74 16.13,12.93 16.51,13.31 v1(16.51,14.34) v1(14.1,16.75) 14.09,16.75 ; 14.09,16.75 13.64,16.3 R25.2 ; 14.09,16.75 13.21,17.63 13.21,19.26 U1.4
  Top Layer w0.203: U6.4 2.29,4.27 v1(2.29,5.69)
  Bottom Layer w0.152: v1(16.51,14.34) 16.51,13.7 8.89,6.08 2.67,6.08 v1(2.29,5.69)
IO1_I2C_SCL: length 32.1
  Top Layer w0.152: R26.2 13.64,13.73 v1(14.43,14.51) ; v1(15.11,16.45) v1(17.22,14.33) 17.22,13.39 16.69,12.86 U9.7 ; U1.5 13.59,18.93 13.59,18.01 15.13,16.47
  Top Layer w0.203: U6.3 v1(4.17,5.44)
  Bottom Layer w0.152: v1(15.11,16.45) 15.11,15.2 v1(14.43,14.51) ; 17.27,14.28 v1(17.22,14.33)
  Bottom Layer w0.203: 17.27,14.28 17.15,14.16 17.15,13.7 8.89,5.44 v1(4.17,5.44)
IO2_LCD_BL: length 27.2
  Top Layer w0.152: U1.6 14.1,18.73 14.1,18.27 20.32,12.05 20.32,10.01 21.46,8.87 v1(24.68,8.87) ; v1(29.69,10.27) R12.1
  Top Layer w0.508: R13.1 R12.1
  Bottom Layer w0.152: v1(24.68,8.87) 25.45,8.11 28.57,8.11 29.69,9.23 v1(29.69,10.27)
IO3_LCD_SCK: length 20
  Top Layer w0.152: 15.56,17.95 arc(15.33,18.41) U1.8 15.24,18.46 15.24,18.27 18.44,15.07 25.87,15.07 27.54,16.74 31.42,16.74
IO4_LCD_CS: length 18.9
  Top Layer w0.152: U1.9 19.25,16.22 24.05,16.22 arc(24.12,16.25) 24.15,16.32 24.15,16.38 arc(24.25,16.48) 24.35,16.38 24.35,16.07 arc(24.45,15.97) 24.55,16.07 24.55,16.38 arc(24.65,16.48) 24.75,16.38 24.75,16.07 arc(24.85,15.97) 24.95,16.07 24.95,16.38 arc(25.05,16.48) 25.15,16.38 25.15,16.07 arc(25.25,15.97) 25.35,16.07 25.35,16.12 arc(25.38,16.19) 25.45,16.22 25.64,16.22 27.16,17.74 31.42,17.74
IO5_LCD_MOSI: length 18.8
  Top Layer w0.152: U1.10 19.34,16.84 21.56,16.84 arc(21.64,16.87) 21.66,16.94 21.66,17 arc(21.76,17.1) 21.86,17 21.86,16.69 arc(21.96,16.59) 22.06,16.69 22.06,17 arc(22.16,17.1) 22.26,17 22.26,16.69 arc(22.36,16.59) 22.46,16.69 22.46,17 arc(22.56,17.1) 22.66,17 22.66,16.69 arc(22.76,16.59) 22.86,16.69 22.86,17 arc(22.96,17.1) 23.06,17 23.06,16.94 arc(23.09,16.87) 23.16,16.84 23.34,16.84 24.74,18.24 31.42,18.24
IO6_LCD_DC: length 14.5
  Top Layer w0.152: U1.12 18.32,19.28 18.82,19.28 19.2,19.67 23.37,19.67 24.29,18.74 31.42,18.74
IO9_BOOT: length 28.9
  Top Layer w0.152: U1.15 18.78,20.96 19.43,20.3 21.72,20.3 24,22.58 BOOT.1
  Top Layer w0.203: v1(34.54,30.71) 34.54,31.22 34.86,31.53 Q1.3
  Top Layer w0.254: R6.2 24,23.81 BOOT.1 v1(25.78,23.09)
  Bottom Layer w0.203: v1(34.54,30.71) 33.4,30.71 v1(25.78,23.09)
  Bottom Layer w0.254: BOOT1.1 25.78,28.05 v1(25.78,23.09)
IO18: length 12.3
  Top Layer w0.203: U1.25 15.61,24.88 15.24,25.25 15.24,25.63 15.38,25.78 17.13,25.78 17.65,25.25
  Top Layer w0.254: v1(19.43,29.19) 19.43,30.27 IO18.1
  Bottom Layer w0.254: IO1.1 19.43,29.5 v1(19.43,29.19) 17.65,27.41 v1(17.65,25.13)
IO19: length 19.6
  Top Layer w0.203: 15.26,24.46 14.86,24.86 14.86,25.89 15.11,26.14 17.78,26.14 v1(18.29,25.63)
  Top Layer w0.254: IO19.1 26.48,29.95 v1(25.53,29.95)
  Bottom Layer w0.254: v1(18.29,25.63) 22.61,29.95 v1(25.53,29.95) 27.29,29.95 IO2.1
RESET: length 44
  Top Layer w0.152: 31.42,17.24 v1(32.64,17.24) ; R7.2 22.53,10.85 RST.2 23.62,10.78 24.03,11.18 C12.1 24.03,12.45 26.92,15.35 v1(28.45,15.35) ; 15.26,19.19 14.6,18.53 14.6,18.27 22.61,10.27
  Top Layer w0.203: v2(35.94,28.68) 36.15,28.68 36.53,29.06 Q1.6
  Bottom Layer w0.152: v2(35.94,28.68) 34.67,27.41 34.67,19.27 v1(32.64,17.24) ; 32.64,17.12 32.64,15.86 32.13,15.35 v1(28.45,15.35)
RTS: length 9.8
  Top Layer w0.203: v2(37.34,32.36) 36.7,32.36 36.53,32.2 Q1.1 37.84,31.53 R8.2 ; v2(34.42,28.68) 34.42,27.09 U2.13
  Bottom Layer w0.203: v2(37.34,32.36) 37.34,31.6 v2(34.42,28.68)
U0RXD: length 33.7
  Top Layer w0.203: U1.27 14.4,24.62 14.4,26.19 14.86,26.65 29.34,26.65 29.84,27.16 31.75,27.16 33.02,25.89 33.02,21.95 33.66,21.32 36.88,21.32 37.08,21.52 37.08,24.43 U2.4
U0TXD: length 15.7
  Top Layer w0.203: R2.2 31.87,26.4 32.64,25.63 32.64,21.7 33.38,20.96 37.03,20.96 37.44,21.37 37.44,25.47 U2.5
$1N1202: length 7.1
  Top Layer w0.203: 12.41,18.77 12.41,19.12 13.85,20.56 13.85,20.6 ; 12.41,18.77 12.32,18.85 12.32,19.54 13.49,20.71 U1.2 ; 12.41,18.77 C2.1
  Top Layer w0.305: C2.1 12.43,18.71 12.43,16.86
$1N1206: length 20.1
  Top Layer w0.203: U1.28 13.97,24.34 13.97,26.27 14.86,27.16 29.08,27.16 29.53,27.61 30.3,27.61 R2.1
$1N1211: length 3.3
  Top Layer w0.355: 12.89,21.06 12.17,20.34 C8.1 11.6,19.92 L2.2
$1N1212: length 2.2
  Top Layer w0.203: 13.85,23.05 12.7,24.19 R1.2
$1N1213: length 10.6
  Top Layer w0.203: 13.19,30.09 12.45,29.35 12.45,27.67 12.75,27.37 13.25,27.37 13.59,27.03 13.59,24.01 U1.29 ; 13.37,30.18 15.65,30.18 15.71,30.12 ; 13.37,30.09 X1.3
$1N1214: length 4.2
  Top Layer w0.203: 11.09,26.36 11.09,28.49 11.17,28.57 ; 12.63,26.71 11.66,27.68 11.66,28.31
$1N1418: length 5
  Top Layer w0.355: L2.1 8.66,19.88 C7.1 4.42,19.88 L1.1
$1N2848: length 1.9
  Top Layer w0.152: C15.2 38.74,25.63 38.35,26.02 U2.6
$1N2873: length 3.1
  Top Layer w0.152: Q1.5 35.88,30.48 35.99,30.59 37.92,30.59 R8.1
$1N2874: length 3.9
  Top Layer w0.203: Q1.2 35.88,32.17 35.69,32.36 34.04,32.36 33.73,32.05 R9.1
$1N5150: length 3.1
  Top Layer w0.254: Q2.3 33.16,14.44 32.86,14.74 31.42,14.74
$1N5159: length 6.2
  Top Layer w0.203: Q2.1 35.43,11.97 35.43,9.25 34.8,8.62 R13.2
$1N5160: length 5.2
  Top Layer w0.508: Q2.2 35.31,14.14 36.96,12.49 36.96,10.65 36.58,10.27 R10.2
$1N13318: length 4.2
  Top Layer w0.254: R21.1 41.36,5.39 42.34,6.37 U7.7
$1N13361: length 3
  Top Layer w0.254: U7.6 41.84,6.76 41.66,6.58 39.77,6.58 R22.1
$1N13443: length 1.9
  Top Layer w0.254: 38.74,8.92 38.74,9.5 39.67,10.43 LED3.2
$1N22115: length 4
  Top Layer w0.203: U9.3 17.19,6.85 C23.2
  Top Layer w0.508: C23.2 17.46,4.88 R28.1
$1N22200: length 4.2
  Top Layer w0.203: R27.1 15.87,6.77 16.69,7.6 U9.2
  Top Layer w0.762: C24.2 15.87,4.86 R27.1

## Copper pours and planes (outline as drawn; the poured copper is in the pictures)
3V3 on Top Layer: 42.71,7.87 46.97,7.87 46.97,-2.19 42.71,-2.19
3V3 on Top Layer: 45.47,7.88 45.47,3.67 43.18,1.37 43.18,-2.5 52.34,-2.5 52.58,-2.27 52.58,7.01 51.71,7.88
3V3 on Top Layer: 25.91,10.01 28.7,10.01 28.7,2.27 25.91,2.27
3V3 on Top Layer: 10.69,14.03 10.69,12.86 10.41,12.58 10.41,-0.27 12.06,-1.92 42.54,-1.92 43.31,-1.16 43.31,5.44 14.86,5.44 14.86,13.57 14.4,14.03
3V3 on Bottom Layer: 20.68,22.18 20.68,9 22.59,7.09 28.7,7.09 28.7,11.16 28.57,11.28 25.53,11.28 23.24,13.57 23.24,20.62 21.69,22.18
+5V on Top Layer: 40.53,34.46 50.64,34.46 50.64,9.04 40.53,9.04
GND on Top Layer: -11.43,41.38 51.94,41.38 51.94,-11.32 -11.43,-11.32
GND on Bottom Layer: -6.22,38.72 54.1,38.72 54.1,-4.85 -6.22,-4.85

Small or netless copper shapes (teardrops, artwork), in the pictures only: 1 on Bottom Layer

## Text on the board
Bottom Silkscreen Layer: IO18 | IO19
